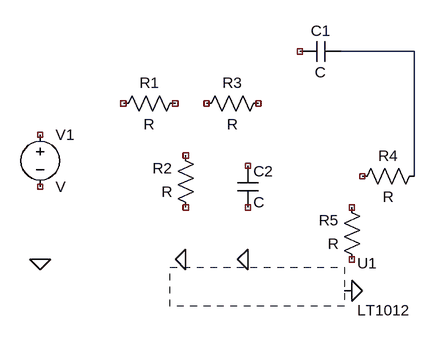
[diagram p0: schematic Project2_P31.asc]
Project2_P31.asc, the LTspice schematic file:
Version 4
SHEET 1 880 680
WIRE 416 48 304 48
WIRE 416 240 416 48
FLAG -160 368 0
FLAG 64 368 0
FLAG 160 368 0
FLAG 320 416 0
SYMBOL OpAmps\\LT1012 304 80 R0
SYMATTR InstName U1
SYMBOL cap 144 224 R0
SYMATTR InstName C2
SYMBOL res 64 112 R90
WINDOW 0 0 56 VBottom 2
WINDOW 3 32 56 VTop 2
SYMATTR InstName R1
SYMBOL res 80 304 R180
WINDOW 0 36 76 Left 2
WINDOW 3 36 40 Left 2
SYMATTR InstName R2
SYMBOL res 80 144 R270
WINDOW 0 32 56 VTop 2
WINDOW 3 0 56 VBottom 2
SYMATTR InstName R3
SYMBOL cap 304 32 R90
WINDOW 0 0 32 VBottom 2
WINDOW 3 32 32 VTop 2
SYMATTR InstName C1
SYMBOL res 432 224 R90
WINDOW 0 0 56 VBottom 2
WINDOW 3 32 56 VTop 2
SYMATTR InstName R4
SYMBOL res 336 384 R180
WINDOW 0 36 76 Left 2
WINDOW 3 36 40 Left 2
SYMATTR InstName R5
SYMBOL voltage -160 160 R0
SYMATTR InstName V1

The netlist it stands for:
* Project2_P31.asc
* U1: LT1012 (symbol OpAmps\LT1012 not available, pin order unknown); nets seen at it: 0
C2 NC_01 NC_02 C
R1 NC_03 NC_04 R
R2 NC_05 NC_06 R
R3 NC_07 NC_08 R
C1 N001 NC_09 C
R4 N001 NC_10 R
R5 NC_11 NC_12 R
V1 NC_13 NC_14 V
.backanno
.end